# EAGLE design DA-15_DB-9_DE-15 (EAGLE 7.3.0)
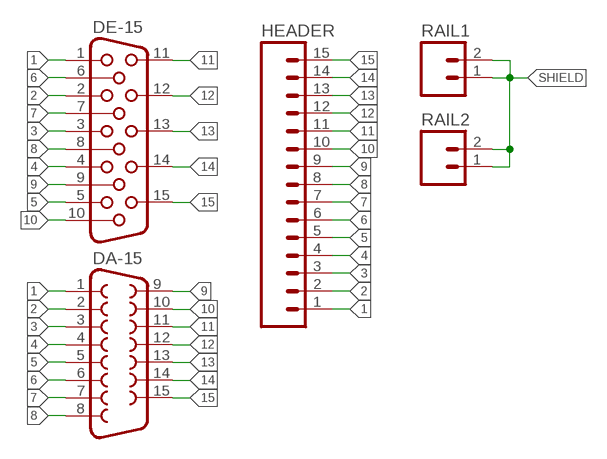
[diagram p0: schematic, sheet 1]

## Parts
DA-15  F15VB  [F15VB]
DE-15  HF15H  [HDF15H]
HEADER  M15  [1X15]
RAIL1  M02PTH  [1X02]
RAIL2  M02PTH  [1X02]

## Nets
1: DA-15.1 DE-15.1 HEADER.1
2: DA-15.2 DE-15.2 HEADER.2
3: DA-15.3 DE-15.3 HEADER.3
4: DA-15.4 DE-15.4 HEADER.4
5: DA-15.5 DE-15.5 HEADER.5
6: DA-15.6 DE-15.6 HEADER.6
7: DA-15.7 DE-15.7 HEADER.7
8: DA-15.8 DE-15.8 HEADER.8
9: DA-15.9 DE-15.9 HEADER.9
10: DA-15.10 DE-15.10 HEADER.10
11: DA-15.11 DE-15.11 HEADER.11
12: DA-15.12 DE-15.12 HEADER.12
13: DA-15.13 DE-15.13 HEADER.13
14: DA-15.14 DE-15.14 HEADER.14
15: DA-15.15 DE-15.15 HEADER.15
SHIELD: RAIL1.1 RAIL1.2 RAIL2.1 RAIL2.2

## Library data of the parts
DA-15 = adafruit:F15: SUB-D HDH is also known as a 'right angle VGA' connector
DE-15 = con-subd:HF15: SUB-D; OC_FARNELL: unknown; OC_NEWARK: unknown
HEADER = SparkFun-Connectors:M15: Header 15 Standard 15-pin 0.1" header. Use with straight break away headers (SKU : PRT-00116), right angle break away headers (PRT-00553), swiss pins (PRT-00743), machine pins (PRT-00117), and female headers (PRT-00115).
RAIL1 RAIL2 = SparkFun-Connectors:M02: Standard 2-pin 0.1" header. Use with - straight break away headers ( PRT-00116) - right angle break away headers (PRT-00553) - swiss pins (PRT-00743) - machine pins (PRT-00117) - female headers (PRT-00115) Molex polarized connector foot print use with: PRT-08233 with associated crimp pins and housings. 2.54_SCREWTERM for use with PRT-10571. 3.5mm Screw Terminal footprints for PRT-08084 5mm Screw Terminal footprints for use with PRT-08432

## Board
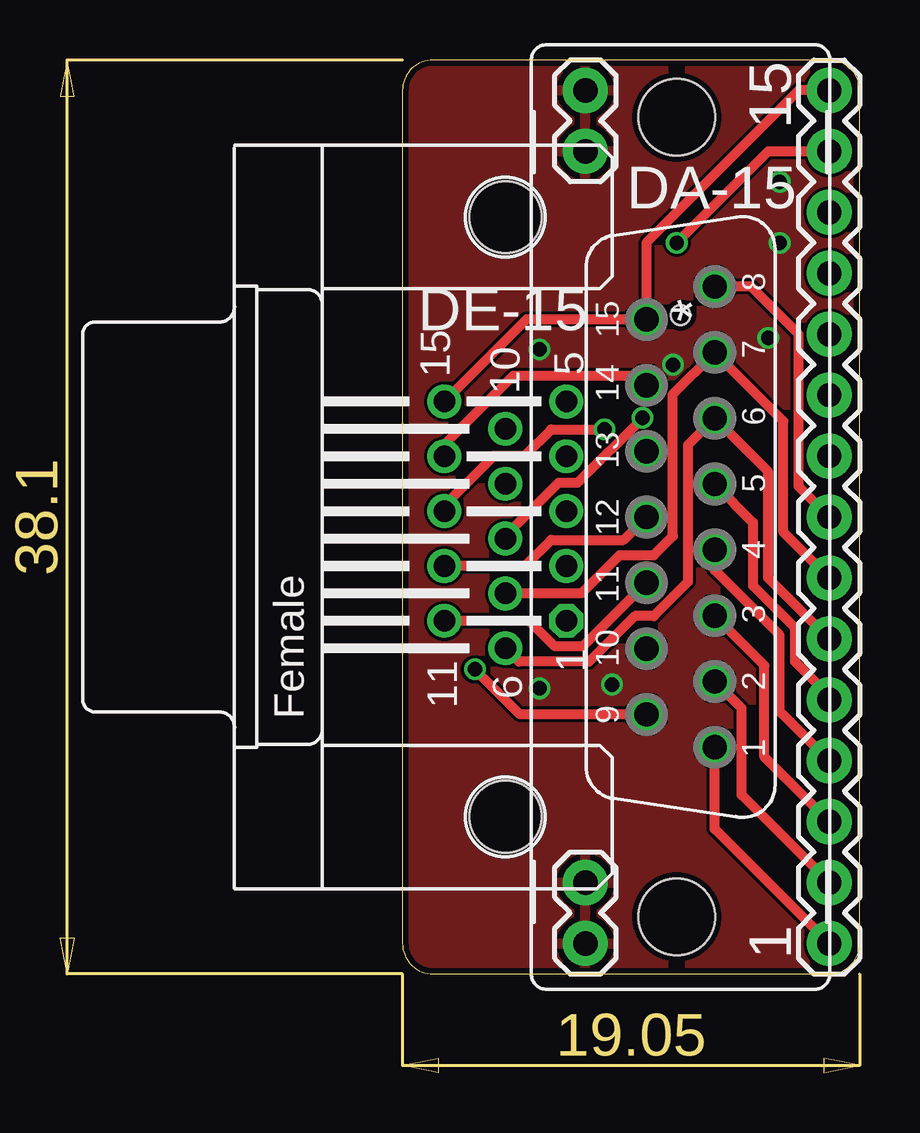
[diagram p1: board, top side]
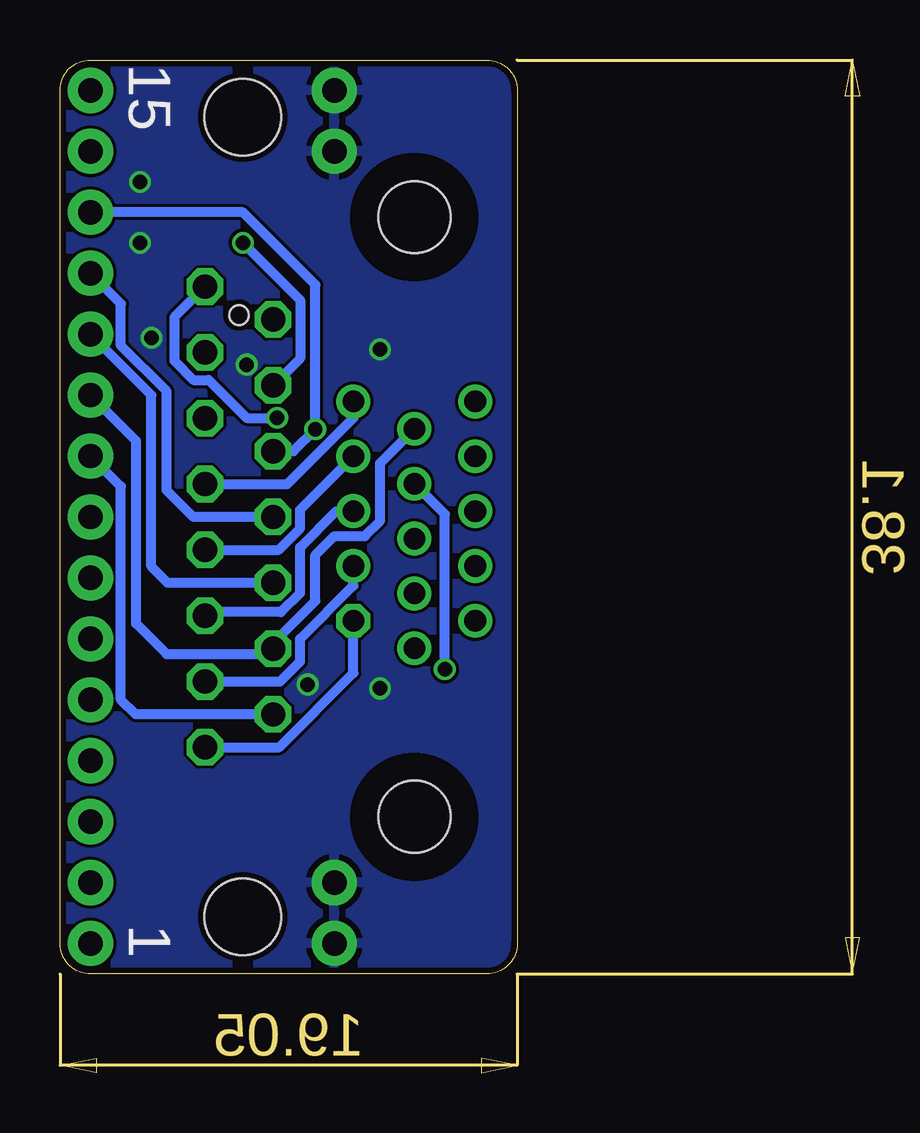
[diagram p2: board, bottom side, seen from below]

Size 19.05 x 38.1 mm. Coordinates in mm from the lower left corner, seen from the top.
Outline: 17.78,38.1 1.27,38.1 arc90 0,36.83 0,1.27 arc90 1.27,0 17.78,0 arc90 19.05,1.27 19.05,36.83 arc90 17.78,38.1
Copper layers (1*16): Top 0.035mm / dielectric 1.5mm / Bottom 0.035mm
Design rules "dirt_cheap_dirty_boards.v1": minimum track width 5mil, minimum drill 12mil, track to track 5mil, track to pad 5mil, pad to pad 5mil, via to via 5mil, smd to smd 0mil, copper to edge 10mil, drill to drill 10mil, minimum pad ring 10mil, minimum via ring 6mil, stop-mask expansion 2mil, vias tented up to drill 25mil, thermal gap 10mil
Holes 3.2 mm at 11.43,2.38 11.43,35.72
Holes 0.8 mm at 11.59,27.46

### Footprints (pad centres in the part's own frame; a part is rotated, then mirrored left to right if it is on the bottom)
F15VB = drill 1.016 octagon: 1 -9.601,-1.422; 2 -6.858,-1.422; 3 -4.115,-1.422; 4 -1.372,-1.422; 5 1.372,-1.422; 6 4.115,-1.422; 7 6.858,-1.422; 8 9.601,-1.422; 9 -8.23,1.422; 10 -5.486,1.422; 11 -2.743,1.422; 12 0,1.422; 13 2.743,1.422; 14 5.486,1.422; 15 8.23,1.422
HDF15H = drill 0.9 octagon: 1 4.329,2.54 | drill 0.9: 2 2.043,2.54; 3 -0.243,2.54; 4 -2.529,2.54; 5 -4.815,2.54; 6 5.472,0; 7 3.186,0; 8 0.9,0; 9 -1.386,0; 10 -3.672,0; 11 4.329,-2.54; 12 2.043,-2.54; 13 -0.243,-2.54; 14 -2.529,-2.54; 15 -4.815,-2.54 | hole 3: -12.5,0; 12.5,0
1X15 = drill 1.016 pad 1.88: 1 0,0; 2 2.54,0; 3 5.08,0; 4 7.62,0; 5 10.16,0; 6 12.7,0; 7 15.24,0; 8 17.78,0; 9 20.32,0; 10 22.86,0; 11 25.4,0; 12 27.94,0; 13 30.48,0; 14 33.02,0; 15 35.56,0
1X02 = drill 1.016 pad 1.88: 1 0,0; 2 2.54,0

### Placement (x,y rotation side)
DA-15  11.59,19.05 90 top
DE-15  4.29,19.05 270 top
HEADER  17.78,1.27 90 top
RAIL1  7.62,1.27 90 top
RAIL2  7.62,36.83 270 top

### Tracks (layer width: path | path; a pad name or v marks a point on that pad's centre or on a via)
1
  Top 0.406: HEADER.1 13.01,6.04 DA-15.1
  Bottom 0.406: DA-15.1 9.92,9.45 6.83,12.54 DE-15.1
2
  Top 0.406: HEADER.2 14.13,7.46 14.13,11.07 DA-15.2
  Bottom 0.406: DA-15.2 9.87,12.19 9.05,13.02 9.05,13.97 6.83,16.19 DE-15.2
3
  Top 0.406: HEADER.3 15.08,9.05 15.08,12.86 DA-15.3
  Bottom 0.406: DE-15.3 7.54,19.29 9.05,17.78 9.05,15.88 9.84,15.08 12.87,15.08 DA-15.3
4
  Top 0.406: HEADER.4 15.72,10.95 15.72,14.13 13.01,16.83 DA-15.4
  Bottom 0.406: DA-15.4 9.94,17.68 9.05,18.57 9.05,19.36 DE-15.4
5
  Top 0.406: DA-15.5 14.61,18.83 14.61,16.19 16.35,14.45 16.35,13.02 17.78,11.59 HEADER.5
  Bottom 0.406: DA-15.5 9.58,20.42 6.83,23.18 DE-15.5
6
  Top 0.406: HEADER.6 15.24,16.51 15.24,20.94 DA-15.6 11.91,22.06 11.91,16.35 10.48,14.92 9.68,14.92 7.78,13.02 4.85,13.02 DE-15.6
7
  Top 0.406: HEADER.7 15.88,18.41 15.88,23.04 DA-15.7 11.27,24.17 11.27,18.26 10.48,17.46 9.05,17.46 7.45,15.86 DE-15.7
8  (via drill 0.6)
  Top 0.406: HEADER.8 16.51,20.32 16.51,26.67 14.53,28.65 DA-15.8 | DE-15.8 4.29,18.26 6.51,20.48 7.3,20.48 v10,23.18
  Bottom 0.406: DA-15.8 14.29,27.38 14.29,25.56 13.49,24.77 12.86,24.77 11.27,23.18 v10,23.18
9  (via drill 0.6)
  Top 0.406: DA-15.9 4.9,10.82 v3.02,12.7
  Bottom 0.406: DA-15.9 15.9,10.82 16.51,11.43 16.51,20.32 HEADER.9 | v3.02,12.7 3.02,19.17 DE-15.9
10
  Bottom 0.406: HEADER.10 15.88,22.23 15.88,14.61 14.61,13.34 10.39,13.34 DA-15.10 10.17,13.8 8.41,15.56 8.41,17.46 7.62,18.26 6.35,18.26 5.71,18.89 5.71,21.29 DE-15.10
11
  Top 0.406: DA-15.11 7.51,13.65 6.35,13.65 5.28,14.72 DE-15.11
  Bottom 0.406: DA-15.11 14.56,16.31 15.24,16.99 15.24,24.13 HEADER.11
12
  Top 0.406: DA-15.12 9.21,18.1 6.19,18.1 5.1,17.01 DE-15.12
  Bottom 0.406: DA-15.12 13.49,19.05 14.61,20.16 14.61,24.29 16.51,26.19 16.51,27.94 HEADER.12
13  (via drill 0.6)
  Top 0.406: DE-15.13 1.75,19.53 3.81,21.59 5.08,21.59 6.19,22.7 v8.41,22.7
  Bottom 0.406: HEADER.13 11.43,31.75 8.41,28.73 v8.41,22.7 9.32,21.79 DA-15.13
14  (via drill 0.6)
  Top 0.406: DA-15.14 9.78,24.92 4.6,24.92 1.75,22.07 DE-15.14 | v11.43,30.48 15.24,34.29 HEADER.14
  Bottom 0.406: v11.43,30.48 9.05,28.1 9.05,25.65 DA-15.14
15
  Top 0.406: DA-15.15 10.16,30.48 16.51,36.83 HEADER.15 | DA-15.15 | DA-15.15 5.17,27.29 DE-15.15
SHIELD  (via drill 0.6)
  other vias: 15.72,33.02 15.72,30.48 5.71,11.91 15.24,26.51 5.71,26.04 11.27,25.4 8.73,12.06
  pour Top: 0,0 19.05,0 19.05,38.1 0,38.1
  pour Bottom: 0,0 19.05,0 19.05,38.1 0,38.1

### Text on the board
tNames: 15 | * | 1
bNames: 15 | 1